# Altium schematic sheet [04] - REVISION HISTORY.SchDoc
size A3; DocumentNumber: 4; SheetNumber: 4; SheetTotal: 4
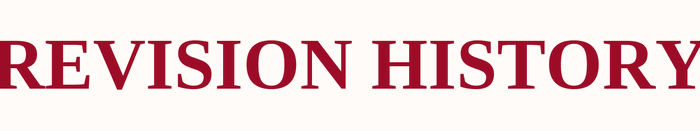
[diagram p0: [04] - REVISION HISTORY.SchDoc]

## Notes on the sheet
- REVISION HISTORY